# EAGLE board main (EAGLE 9.0.0)
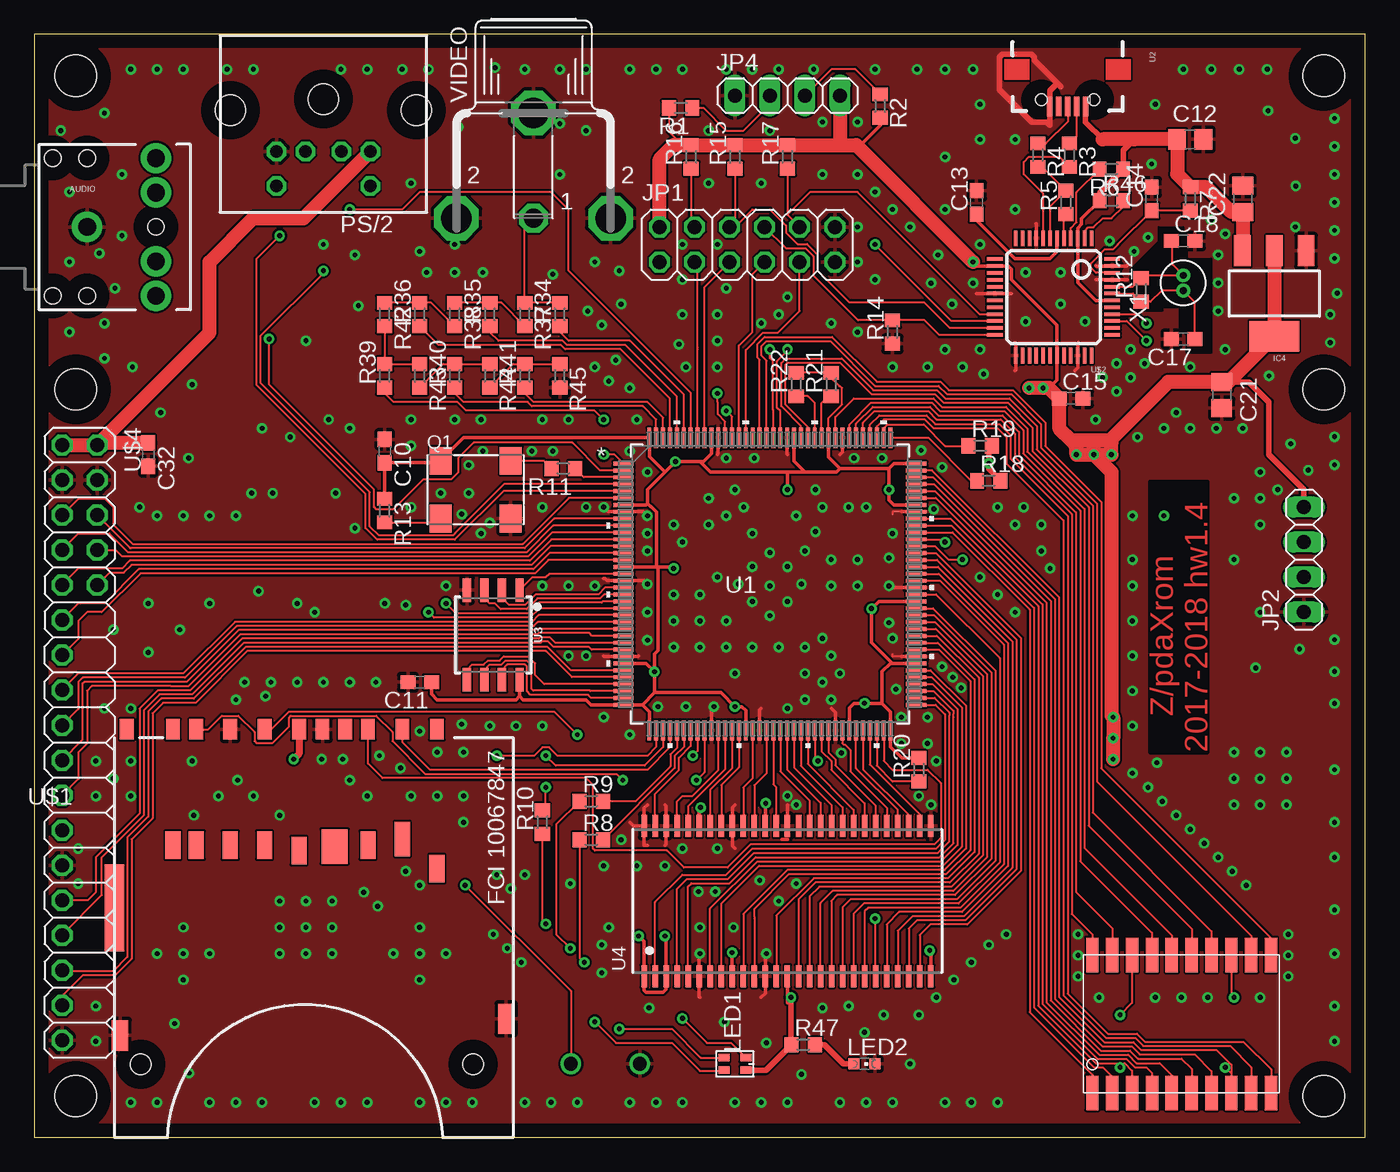
[diagram p3: board, top side]
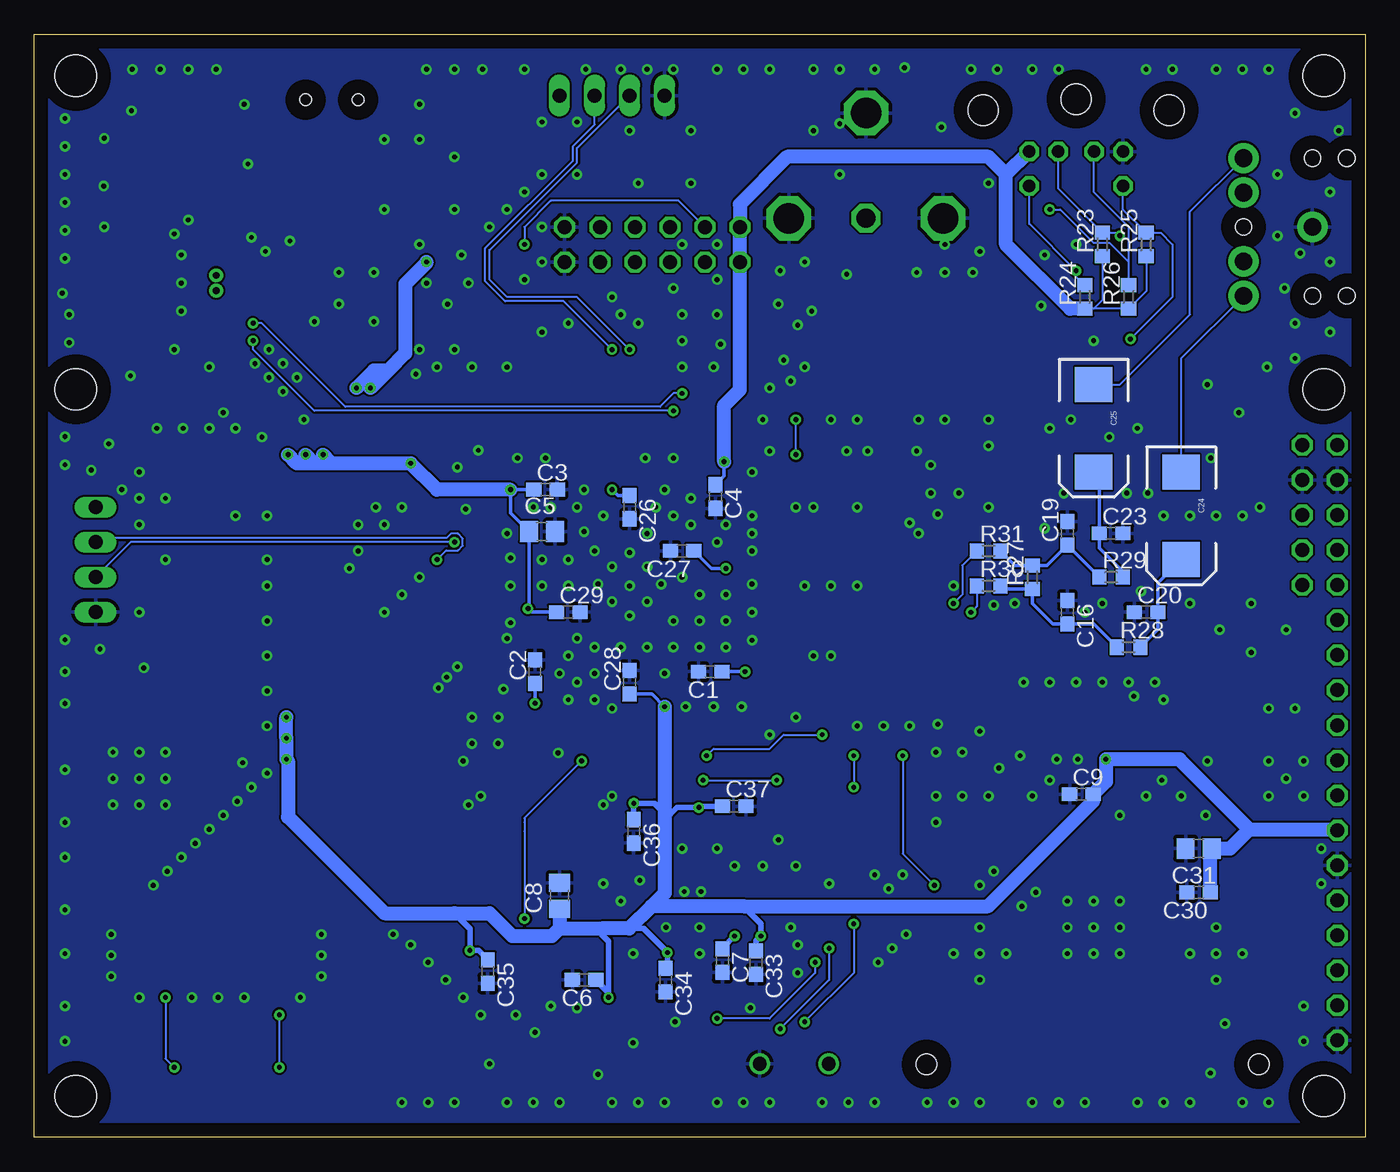
[diagram p4: board, bottom side, seen from below]

Size 96.5 x 80 mm. Coordinates in mm from the lower left corner, seen from the top.
Outline: 0,0 96.5,0 96.5,80 0,80 0,0
Copper layers (1*16): Top 0.035mm / dielectric 1.5mm / Bottom 0.035mm
Design rules "default *": minimum track width 6mil, minimum drill 0.35mm, track to track 6mil, track to pad 6mil, pad to pad 6mil, via to via 6mil, smd to smd 6mil, copper to edge 40mil, drill to drill 6mil, minimum pad ring 10mil, minimum via ring 8mil, stop-mask expansion 4mil, vias tented up to drill 0.4mm, thermal gap 10mil
Holes 3 mm at 3,3 93.5,77 93.5,3 3,77 3,54.26 93.5,54.26
tRestrict: area 79,56.9 to 85.3,66; area 57.8,51.4 to 59.1,52.1; area 54,51.4 to 55.2,52.1; area 76.7,2 to 89.4,2.5; area 76.7,13.7 to 89.4,14.2

## Footprints (pad centres in the part's own frame; a part is rotated, then mirrored left to right if it is on the bottom)
AUDIO-JACK = drill 1.3 pad 2.184: RING 5,5; RSH 5,2.5; SLEEVE 0,0; TIP 5,-5; TSH 5,-2.5 | hole 1.2: 0,5; -2.5,5; -2.5,-5; 0,-5; 5,0
C0603 = smd 1.1 x 1: 1 -0.85,0; 2 0.85,0
C0805 = smd 1.3 x 1.5: 1 -0.95,0; 2 0.95,0
EIA7343 = smd 2.55 x 2.7: A 3.17,0; C -3.17,0
SOT223 = smd 1.219 x 2.235: 1 -2.311,-3.099; 2 0,-3.099; 3 2.311,-3.099 | smd 3.6 x 2.2: 4 0,3.099
2X06 = drill 1.016 octagon: 1 -6.35,-1.27; 2 -6.35,1.27; 3 -3.81,-1.27; 4 -3.81,1.27; 5 -1.27,-1.27; 6 -1.27,1.27; 7 1.27,-1.27; 8 1.27,1.27; 9 3.81,-1.27; 10 3.81,1.27; 11 6.35,-1.27; 12 6.35,1.27
1X04 = drill 1.016 long: 1 -3.81,0; 2 -1.27,0; 3 1.27,0; 4 3.81,0
19-237/R6GHBHC-A04/2T = smd 0.55 x 0.8: P$1 0.45,-0.8; P$2 0.45,0.8; P$3 -0.45,-0.8; P$4 -0.45,0.8
CHIPLED_0603 = smd 0.8 x 0.8: A 0,-0.75; C 0,0.75
MDIN06SS = drill 0.9 octagon: 1 1.3,8.5; 2 -1.3,8.5; 3 3.4,8.5; 4 -3.4,8.5; 5 3.4,11; 6 -3.4,11 | hole 2.2: -6.75,5.5; 0,4.7; 6.75,5.5
7.0X5.0_KXO-82-TCXO = smd 1.6 x 2: 1 -2.54,-2.1; 2 2.54,-2.1; 3 2.54,2.1; 4 -2.54,2.1
R0603 = smd 1 x 1.1: 1 -0.85,0; 2 0.85,0
TQFP144 = smd 1.473 x 0.279: 1 -10.617,8.75; 2 -10.617,8.25; 3 -10.617,7.75; 4 -10.617,7.25; 5 -10.617,6.75; 6 -10.617,6.25; 7 -10.617,5.75; 8 -10.617,5.25; 9 -10.617,4.75; 10 -10.617,4.25; 11 -10.617,3.75; 12 -10.617,3.25; 13 -10.617,2.75; 14 -10.617,2.25; 15 -10.617,1.75; 16 -10.617,1.25; 17 -10.617,0.75; 18 -10.617,0.25; 19 -10.617,-0.25; 20 -10.617,-0.75; 21 -10.617,-1.25; 22 -10.617,-1.75; 23 -10.617,-2.25; 24 -10.617,-2.75; 25 -10.617,-3.25; 26 -10.617,-3.75; 27 -10.617,-4.25; 28 -10.617,-4.75; 29 -10.617,-5.25; 30 -10.617,-5.75; 31 -10.617,-6.25; 32 -10.617,-6.75; 33 -10.617,-7.25; 34 -10.617,-7.75; 35 -10.617,-8.25; 36 -10.617,-8.75; 73 10.617,-8.75; 74 10.617,-8.25; 75 10.617,-7.75; 76 10.617,-7.25; 77 10.617,-6.75; 78 10.617,-6.25; 79 10.617,-5.75; 80 10.617,-5.25; 81 10.617,-4.75; 82 10.617,-4.25; 83 10.617,-3.75; 84 10.617,-3.25; 85 10.617,-2.75; 86 10.617,-2.25; 87 10.617,-1.75; 88 10.617,-1.25; 89 10.617,-0.75; 90 10.617,-0.25; 91 10.617,0.25; 92 10.617,0.75; 93 10.617,1.25; 94 10.617,1.75; 95 10.617,2.25; 96 10.617,2.75; 97 10.617,3.25; 98 10.617,3.75; 99 10.617,4.25; 100 10.617,4.75; 101 10.617,5.25; 102 10.617,5.75; 103 10.617,6.25; 104 10.617,6.75; 105 10.617,7.25; 106 10.617,7.75; 107 10.617,8.25; 108 10.617,8.75 | smd 0.279 x 1.473: 37 -8.75,-10.617; 38 -8.25,-10.617; 39 -7.75,-10.617; 40 -7.25,-10.617; 41 -6.75,-10.617; 42 -6.25,-10.617; 43 -5.75,-10.617; 44 -5.25,-10.617; 45 -4.75,-10.617; 46 -4.25,-10.617; 47 -3.75,-10.617; 48 -3.25,-10.617; 49 -2.75,-10.617; 50 -2.25,-10.617; 51 -1.75,-10.617; 52 -1.25,-10.617; 53 -0.75,-10.617; 54 -0.25,-10.617; 55 0.25,-10.617; 56 0.75,-10.617; 57 1.25,-10.617; 58 1.75,-10.617; 59 2.25,-10.617; 60 2.75,-10.617; 61 3.25,-10.617; 62 3.75,-10.617; 63 4.25,-10.617; 64 4.75,-10.617; 65 5.25,-10.617; 66 5.75,-10.617; 67 6.25,-10.617; 68 6.75,-10.617; 69 7.25,-10.617; 70 7.75,-10.617; 71 8.25,-10.617; 72 8.75,-10.617; 109 8.75,10.617; 110 8.25,10.617; 111 7.75,10.617; 112 7.25,10.617; 113 6.75,10.617; 114 6.25,10.617; 115 5.75,10.617; 116 5.25,10.617; 117 4.75,10.617; 118 4.25,10.617; 119 3.75,10.617; 120 3.25,10.617; 121 2.75,10.617; 122 2.25,10.617; 123 1.75,10.617; 124 1.25,10.617; 125 0.75,10.617; 126 0.25,10.617; 127 -0.25,10.617; 128 -0.75,10.617; 129 -1.25,10.617; 130 -1.75,10.617; 131 -2.25,10.617; 132 -2.75,10.617; 133 -3.25,10.617; 134 -3.75,10.617; 135 -4.25,10.617; 136 -4.75,10.617; 137 -5.25,10.617; 138 -5.75,10.617; 139 -6.25,10.617; 140 -6.75,10.617; 141 -7.25,10.617; 142 -7.75,10.617; 143 -8.25,10.617; 144 -8.75,10.617
USB-MICRO-SMD = smd 1.4 x 0.4: D+1 2.7,0; D-1 2.7,0.65; GND1 2.7,-1.3; ID1 2.7,-0.65; VBUS1 2.7,1.3 | hole 0.85: 2.2,1.9; 2.2,-1.9
SOIC-8 = smd 0.61 x 1.702: 1 -1.905,-3.251; 2 -0.635,-3.251; 3 0.635,-3.251; 4 1.905,-3.251; 5 1.905,3.251; 6 0.635,3.251; 7 -0.635,3.251; 8 -1.905,3.251
TSOP54 = smd 0.4 x 1.6: 1 -10.4,-5.45; 2 -9.6,-5.45; 3 -8.8,-5.45; 4 -8,-5.45; 5 -7.2,-5.45; 6 -6.4,-5.45; 7 -5.6,-5.45; 8 -4.8,-5.45; 9 -4,-5.45; 10 -3.2,-5.45; 11 -2.4,-5.45; 12 -1.6,-5.45; 13 -0.8,-5.45; 14 0,-5.45; 15 0.8,-5.45; 16 1.6,-5.45; 17 2.4,-5.45; 18 3.2,-5.45; 19 4,-5.45; 20 4.8,-5.45; 21 5.6,-5.45; 22 6.4,-5.45; 23 7.2,-5.45; 24 8,-5.45; 25 8.8,-5.45; 26 9.6,-5.45; 27 10.4,-5.45; 28 10.4,5.45; 29 9.6,5.45; 30 8.8,5.45; 31 8,5.45; 32 7.2,5.45; 33 6.4,5.45; 34 5.6,5.45; 35 4.8,5.45; 36 4,5.45; 37 3.2,5.45; 38 2.4,5.45; 39 1.6,5.45; 40 0.8,5.45; 41 0,5.45; 42 -0.8,5.45; 43 -1.6,5.45; 44 -2.4,5.45; 45 -3.2,5.45; 46 -4,5.45; 47 -4.8,5.45; 48 -5.6,5.45; 49 -6.4,5.45; 50 -7.2,5.45; 51 -8,5.45; 52 -8.8,5.45; 53 -9.6,5.45; 54 -10.4,5.45
SD-MMC_SOCKET-PP = smd 1 x 1.5: 1 6.875,29.6; 2 4.375,29.6; 3 1.075,29.6; 4 -0.625,29.6; 5 -3.125,29.6; 6 -5.625,29.6; 7 -8.075,29.6; 8 -9.775,29.6; 9 9.375,29.6; CD 2.725,29.6; WP -13.125,29.6 | smd 1.4 x 6.3: 14 -14,16.65 | smd 1.2 x 2.2: SHLD1 -13.6,7.4; SHLD2 14.4,8.6 | smd 1.1 x 2: SW -9.775,21.2; SW1 -8.075,21.2; SW2 -5.625,21.2; SW3 -3.125,21.2; SW4 -0.625,20.8; SW6 4.375,21.2; SW8 9.375,19.5 | smd 1.9 x 2.5: SW5 1.95,21.1 | smd 1.1 x 2.5: SW7 6.875,21.65 | hole 1.5: -12.1,5.3; 12,5.3
LQFP-48 = smd 0.254 x 1.143: 1 -2.75,-4.25; 2 -2.25,-4.25; 3 -1.75,-4.25; 4 -1.25,-4.25; 5 -0.75,-4.25; 6 -0.25,-4.25; 7 0.25,-4.25; 8 0.75,-4.25; 9 1.25,-4.25; 10 1.75,-4.25; 11 2.25,-4.25; 12 2.75,-4.25; 25 2.75,4.25; 26 2.25,4.25; 27 1.75,4.25; 28 1.25,4.25; 29 0.75,4.25; 30 0.25,4.25; 31 -0.25,4.25; 32 -0.75,4.25; 33 -1.25,4.25; 34 -1.75,4.25; 35 -2.25,4.25; 36 -2.75,4.25 | smd 1.143 x 0.254: 13 4.25,-2.75; 14 4.25,-2.25; 15 4.25,-1.75; 16 4.25,-1.25; 17 4.25,-0.75; 18 4.25,-0.25; 19 4.25,0.25; 20 4.25,0.75; 21 4.25,1.25; 22 4.25,1.75; 23 4.25,2.25; 24 4.25,2.75; 37 -4.25,2.75; 38 -4.25,2.25; 39 -4.25,1.75; 40 -4.25,1.25; 41 -4.25,0.75; 42 -4.25,0.25; 43 -4.25,-0.25; 44 -4.25,-0.75; 45 -4.25,-1.25; 46 -4.25,-1.75; 47 -4.25,-2.25; 48 -4.25,-2.75
GS2020CR = smd 0.9 x 2.5: 1 -6.46,-5.02; 2 -5.02,-5.02; 3 -3.58,-5.02; 4 -2.14,-5.02; 5 -0.7,-5.02; 6 0.74,-5.02; 7 2.18,-5.02; 8 3.62,-5.02; 9 5.06,-5.02; 10 6.5,-5.02; 11 6.5,4.98; 12 5.06,4.98; 13 3.62,4.98; 14 2.18,4.98; 15 0.74,4.98; 16 -0.7,4.98; 17 -2.14,4.98; 18 -3.58,4.98; 19 -5.02,4.98; 20 -6.46,4.98
2X18_ZPDAXROM_IO = drill 1.016 octagon: 1 -21.59,-1.27; 2 -21.59,1.27; 3 -19.05,-1.27; 4 -19.05,1.27; 5 -16.51,-1.27; 6 -16.51,1.27; 7 -13.97,-1.27; 8 -13.97,1.27; 9 -11.43,-1.27; 10 -11.43,1.27; 11 -8.89,-1.27; 13 -6.35,-1.27; 15 -3.81,-1.27; 17 -1.27,-1.27; 19 1.27,-1.27; 21 3.81,-1.27; 23 6.35,-1.27; 25 8.89,-1.27; 27 11.43,-1.27; 29 13.97,-1.27; 31 16.51,-1.27; 33 19.05,-1.27; 35 21.59,-1.27
SWITCH_6X6 = drill 1: P$1 -2.5,0; P$2 2.5,0
TOBU3 = drill 1.397 octagon: 1 0,-2.54 | drill 2.21 octagon: 2 5.588,-2.54; 2@1 -5.588,-2.54; 2@2 0,5.08
WATCH-3X8 = drill 0.5 pad 0.9: 1 -0.55,0; 2 0.55,0

## Placement (x,y rotation side)
AUDIO  AUDIO-JACK2PTH  [AUDIO-JACK]  3.81,66.04 0 top
C1  100nF  [C0603]  47.5,33.78 180 bottom
C2  100nF  [C0603]  60.2,33.78 90 bottom
C3  100nF  [C0603]  59.44,46.99 0 bottom
C4  100nF  [C0603]  47.12,46.48 270 bottom
C5  10uF  [C0805]  59.69,43.94 0 bottom
C6  100nF  [C0603]  56.64,11.43 180 bottom
C7  100nF  [C0603]  46.61,12.83 270 bottom
C8  10uF  [C0805]  58.42,17.53 90 bottom
C9  100nF  [C0603]  20.57,24.89 0 bottom
C10  100nF  [C0603]  25.4,49.78 270 top
C11  100nF  [C0603]  27.94,33.02 180 top
C12  10uF  [C0805]  83.82,72.39 0 top
C13  100nF  [C0603]  68.33,67.82 90 top
C14  100nF  [C0603]  81.03,68.07 90 top
C15  100nF  [C0603]  75.18,53.59 0 top
C16  10nF  [C0603]  21.59,38.1 270 bottom
C17  27pF  [C0603]  83.31,57.91 180 top
C18  27pF  [C0603]  83.31,65.02 0 top
C19  10nF  [C0603]  21.59,43.81 90 bottom
C20  10nF  [C0603]  15.88,38.1 0 bottom
C21  10uF  [C0805]  86.11,53.85 270 top
C22  10uF  [C0805]  87.63,68.07 90 top
C23  10nF  [C0603]  18.41,43.81 0 bottom
C24  100uF  [EIA7343]  13.34,45.09 270 bottom
C25  100uF  [EIA7343]  19.68,51.44 270 bottom
C26  100nF  [C0603]  53.34,45.72 270 bottom
C27  100nF  [C0603]  49.53,42.55 180 bottom
C28  100nF  [C0603]  53.34,33.02 90 bottom
C29  100nF  [C0603]  57.78,38.1 0 bottom
C30  100nF  [C0603]  12.06,17.78 180 bottom
C31  10uF  [C0805]  12.06,20.95 180 bottom
C32  100nF  [C0603]  8.26,49.53 270 top
C33  100nF  [C0603]  44.17,12.67 270 bottom
C34  100nF  [C0603]  50.72,11.4 270 bottom
C35  100nF  [C0603]  63.63,12.04 270 bottom
C36  100nF  [C0603]  53.04,22.2 270 bottom
C37  100nF  [C0603]  45.75,24.03 0 bottom
IC4  [SOT223]  89.92,61.21 180 top
JP1  [2X06]  51.69,64.77 0 top
JP2  [1X04]  92.08,41.91 90 top
JP4  [1X04]  54.61,75.56 0 top
LED1  19-237/R6GHBHC-A04/2T  [19-237/R6GHBHC-A04/2T]  50.8,5.33 90 top
LED2  [CHIPLED_0603]  60.2,5.33 270 top
PS/2  [MDIN06SS]  20.95,80.01 180 top
Q1  [7.0X5.0_KXO-82-TCXO]  32,46.99 0 top
R1  4.7K  [R0603]  46.86,74.68 180 top
R2  4.7K  [R0603]  61.34,74.8 270 top
R3  27  [R0603]  75.06,71.25 270 top
R4  27  [R0603]  72.77,71.25 270 top
R5  1k5  [R0603]  74.8,67.82 90 top
R6  1K  [R0603]  78.11,70.23 180 top
R7  470  [R0603]  83.82,68.07 270 top
R8  1K  [R0603]  40.39,21.59 0 top
R9  1K  [R0603]  40.39,24.38 0 top
R10  1K  [R0603]  36.83,22.86 90 top
R11  10  [R0603]  38.35,48.51 180 top
R12  DNP  [R0603]  80.26,61.47 90 top
R13  DNP  [R0603]  25.4,45.47 270 top
R14  4.7K  [R0603]  62.23,58.42 90 top
R15  DNP  [R0603]  50.8,71.12 90 top
R16  DNP  [R0603]  47.62,71.12 90 top
R17  DNP  [R0603]  54.61,71.12 90 top
R18  10K  [R0603]  69.22,47.62 0 top
R19  10K  [R0603]  68.58,50.16 0 top
R20  10K  [R0603]  64.14,26.67 90 top
R21  10K  [R0603]  57.78,54.61 90 top
R22  10K  [R0603]  55.24,54.61 90 top
R23  10K  [R0603]  19.05,64.77 90 bottom
R24  10K  [R0603]  20.32,60.96 90 bottom
R25  10K  [R0603]  15.88,64.77 90 bottom
R26  10K  [R0603]  17.14,60.96 90 bottom
R27  1K  [R0603]  24.13,40.64 90 bottom
R28  560  [R0603]  17.14,35.56 0 bottom
R29  560  [R0603]  18.41,40.64 0 bottom
R30  560  [R0603]  27.3,40.01 0 bottom
R31  560  [R0603]  27.3,42.55 0 bottom
R34  230  [R0603]  38.1,59.69 90 top
R35  230  [R0603]  33.02,59.69 90 top
R36  230  [R0603]  27.94,59.69 90 top
R37  115  [R0603]  35.56,59.69 270 top
R38  115  [R0603]  30.48,59.69 270 top
R39  230  [R0603]  25.4,55.24 90 top
R40  230  [R0603]  30.48,55.24 90 top
R41  230  [R0603]  35.56,55.24 90 top
R42  115  [R0603]  25.4,59.69 270 top
R43  115  [R0603]  27.94,55.24 270 top
R44  115  [R0603]  33.02,55.24 270 top
R45  230  [R0603]  38.1,55.24 270 top
R46  10K  [R0603]  78.11,67.94 0 top
R47  1K  [R0603]  55.75,6.73 0 top
U1  LCMXO2-7000HC-4TG144I  [TQFP144]  53.34,40.13 0 top
U2  [USB-MICRO-SMD]  74.93,77.47 270 top
U3  W25Q32FV  [SOIC-8]  33.27,36.45 180 top
U4  K4S561632E-TC  [TSOP54]  54.61,17.14 0 top
U$1  [SD-MMC_SOCKET-PP]  19.81,0 0 top
U$2  FT2232D  [LQFP-48]  73.91,60.96 180 top
U$3  GS2020CR-G  [GS2020CR]  83.19,8.26 0 top
U$4  ZPDAXROM_IO  [2X18_ZPDAXROM_IO]  3.27,28.63 270 top
U$12  SWITCH_6X6  [SWITCH_6X6]  41.4,5.33 0 top
VIDEO  TOBU3  [TOBU3]  36.2,69.22 0 top
X1  CRYSTALS-NOGND-WATCH-3X8  [WATCH-3X8]  83.31,61.98 90 top

## Tracks (layer width: path | path; a pad name or v marks a point on that pad's centre or on a via)
+3V3  (via drill 0.35)
  Top 0.152: U1.118 57.59,52.19 58.56,53.16 58.56,54.35 58.43,54.49 58.37,54.49 57.59,55.27 R21.2 R22.2 | R1.2 46.01,72.95 46.99,71.97
  Top 0.254: R13.1 C10.2 29.31,48.93 Q1.4 31.12,50.75 U1.144 44.59,49.39 45.72,48.26 | U1.7 44.36,45.88 44.45,45.97 | 44.45,45.97 44.45,46.99 45.72,48.26 | 45.72,48.26 v46.48,49.02 48.26,49.02 | U1.135 49.09,49.6 48.51,49.02 48.26,49.02 | U1.108 62.34,48.88 61.98,48.51 | 61.98,48.51 v61.98,46.99 61.98,46.23 62.32,45.88 U1.102 | U1.118 57.59,49.34 58.42,48.51 | 58.42,48.51 61.98,48.51 | 61.47,31.5 62.09,30.87 U1.72 62.09,28.33 62.9,27.52 R20.2 | 61.47,31.5 v60.2,31.5 59.44,31.5 59.09,31.15 U1.66 | 62.06,34.38 62.15,34.46 60.71,35.9 v60.71,38.35 61.23,38.88 U1.88 | 62.06,34.38 61.47,33.78 61.47,31.5 | U1.30 44.36,34.38 v44.96,33.78 | 44.08,31.38 U1.36 40.37,31.38 40.01,31.75 35.43,31.75 35.18,32 | 44.08,31.38 44.96,32.26 | 44.96,32.26 v44.96,33.78 | U1.51 51.59,30.96 51.31,31.24 v50.8,31.24 49.78,32.26 44.96,32.26 | U1.37 44.59,30.87 44.08,31.38 | v44.96,33.78 44.96,35.05 45.21,35.31 45.21,41.26 45.11,41.36 | 48.26,49.02 49.02,48.26 54.61,48.26 | 58.42,48.51 58.17,48.26 55.88,48.26 | 54.61,48.26 55.88,48.26 | U1.123 55.09,49.05 55.88,48.26 | U3.8 35.18,32 | 35.18,32 34.92,31.75 29.21,31.75 28.79,32.17 C11.1 | U1.16 45.09,41.38 | 45.09,41.38 46.25,41.38 v46.35,41.27 | 45.11,41.36 45.09,41.38 | 44.45,45.97 44.68,45.74 44.72,45.74 45.11,45.36 45.11,41.36 | 54.61,48.26 v54.61,46.99 | R2.2 61.34,73.41 59.91,71.97 59.6,71.97 | v68.07,63.5 68.36,63.21 U$2.14 70.65,63.21 70.87,62.99 70.87,62.23 74.17,58.93 U$2.31 74.16,54.95 73.57,54.36 | U1.79 62.06,34.38 | U4.14 54.61,9.78 v54.86,10.16 | v43.81,14.61 44.21,14.21 U4.1 44.21,10.65 44.35,10.52 45.57,10.52 45.81,10.76 U4.3 45.81,14.52 v45.72,14.61 | U4.49 48.21,23.83 v48.31,23.93
  Top 0.254: U4.43 53.01,24.21 v53.03,24.23 | U4.9 50.6,11.71 v50.6,13.41 | U4.27 65.01,13.48 v64.92,13.56
  Top 0.406: R19.2 69.22,49.95 v69.22,48.9 69.22,48.48 R18.2 | v54.86,10.16 54.86,6.77 R47.1 53.06,4.88 LED1.P$3 | JP2.4 92.08,46.99 89.53,49.53 89.53,53.34 88.08,54.8 86.6,54.8
  Top 0.508: U$1.4 19.19,27.82 v18.8,27.43
  Top 1.016: 77.98,50.55 76.71,50.55 | 76.71,50.55 75.18,50.55 | 58.42,71.97 R17.2 R15.2 R16.2 46.99,71.97 46.35,71.97 45.34,70.95 JP1.2 | 58.42,71.97 59.6,71.97 v68.07,63.5 | 75.18,50.55 75.56,50.16 v75.56,49.53 v76.83,49.53 | v76.83,49.53 76.83,50.42 76.71,50.55 | 77.98,50.55 78.11,50.42 v78.11,49.53 v76.83,49.53 | v78.23,27.43 v78.23,28.96 v78.23,30.48 78.11,30.61 78.11,48.26 v76.83,49.53 | 75.18,50.55 74.33,51.4 C15.1 73.57,54.36 v73.15,54.36 v72.14,54.36 | JP4.4 58.42,71.97 | 77.98,50.55 82.23,54.8 C21.1 86.6,54.8 IC4.4 IC4.2 | U$4.2 12.7,58.38 12.7,63.5 15.88,66.67 19.52,66.67 PS/2.4 | U$4.1 U$4.2 | C32.1 4.7,50.38 U$4.2
  Bottom 0.152: R25.1 15.88,61.38 R26.1 19.68,60.11 | 19.68,60.11 R24.1 | R23.1 19.05,60.74 19.68,60.11
  Bottom 0.254: C3.1 v61.98,46.99 61.98,45.28 C5.1 60.64,38.42 v60.71,38.35 60.45,38.1 C29.1 | C2.1 v60.2,31.5 | C1.1 v44.96,33.78 | C27.1 47.41,41.27 v46.35,41.27 | C4.1 46.48,47.97 v46.48,49.02 | C26.1 54.19,46.57 v54.61,46.99 | C28.1 51.73,32.17 v50.8,31.24
  Bottom 0.406: 55.37,15.15 55.37,14.73 54.86,14.22 v54.86,10.16 | 53.36,15.15 52.34,15.15 v50.6,13.41 50.6,12.38 C34.1 | 45.09,16.76 43.81,15.49 v43.81,14.61 44.17,14.25 C33.1 | C37.1 48.21,24.03 v48.31,23.93 49.89,23.93 50.8,23.01 | C36.1 v53.03,24.23 51.54,24.23 50.8,23.5 | C35.1 64.3,13.56 v64.92,13.56 64.92,15.14 66.04,16.26 | 54.86,10.35 v54.86,10.16 | C7.1 46.61,13.72 v45.72,14.61 | C6.1 54.86,10.5 v54.86,10.16
  Bottom 1.016: 51.75,16.76 45.09,16.76 27.34,16.76 19.72,24.38 C9.2 18.8,25.82 v18.8,27.43 13.46,27.43 8.38,22.35 | v50.8,31.24 50.8,23.5 50.8,23.01 50.8,17.71 51.75,16.76 | v61.98,46.99 67.31,46.99 v69.22,48.9 74.93,48.9 | 74.93,48.9 v75.56,49.53 | v46.48,49.02 46.48,53.09 45.34,54.23 JP1.1 JP1.2 45.34,67.69 41.91,71.12 27.3,71.12 26.04,69.85 | v78.23,30.48 v78.23,28.96 v78.23,27.43 78.11,27.3 78.11,23.24 71.12,16.26 66.04,16.26 63.5,16.26 61.85,14.61 58.97,14.61 58.42,15.15 | 70.87,55.63 69.62,56.87 69.62,61.9 68.07,63.45 v68.07,63.5 | 70.87,55.63 v72.14,54.36 | 74.93,48.9 76.2,48.9 | 76.2,48.9 v76.83,49.53 | 76.2,48.9 77.47,48.9 v78.11,49.53 | 70.87,55.63 71.88,55.63 v73.15,54.36 | R24.1 21.38,60.11 26.04,64.77 26.04,69.85 | U$4.23 2.07,22.35 8.38,22.35 | 26.04,69.85 24.38,71.51 PS/2.4 | 8.38,22.35 9.78,20.95 C31.1 11.21,20.86 C30.1 | 51.75,16.76 53.36,15.15 55.37,15.15 58.42,15.15 | C8.1 58.42,15.15
+5V
  Top 0.254: U$2.42 76.97,60.71 | 76.97,60.71 76.96,60.71 | 76.97,60.71 75.66,62.01 U$2.3 75.66,65.95 75.94,66.23 75.94,66.63 R46.1
  Top 0.406: 76.23,74.14 U2.VBUS1 76.23,73.63 77.47,72.39 | 82.62,72.14 C12.1 | R46.1 77.25,68.53 R6.1 78.95,71.59 79.76,72.39
  Top 1.016: 77.47,72.39 79.76,72.39 C12.1 82.87,69.87 R7.1 85,68.92 86.8,67.12 C22.1 87.63,64.34 IC4.3
AUDIO_L  (via drill 0.35)
  Top 0.152: U1.22 36.63,38.38 35.96,37.71 28.97,37.71 v28.57,38.1
  Bottom 0.152: R30.1 28.16,38.52 v28.57,38.1
AUDIO_R  (via drill 0.35)
  Top 0.152: U1.21 41.24,38.88 41.14,38.79 36.61,38.79 35.83,38.01 31.75,38.01 31.58,38.01 30.57,38.01 v29.84,38.73
  Bottom 0.152: R31.1 29.21,41.49 29.21,39.37 v29.84,38.73
BTN_RES  (via drill 0.35)
  Top 0.152: U1.38 45.09,28.33 44.45,27.69 37.94,27.69 37.34,28.29 36.83,28.29 36.23,27.69 v33.53,27.69 | v31.24,18.29 38.9,10.63 U$12.P$1
  Bottom 0.152: v33.53,27.69 33.53,20.57 v31.24,18.29
DONE
  Top 0.152: U1.109 64.82,50.75 67.94,47.62 R18.1
DRAM_A0
  Top 0.152: U1.92 65.59,40.88 70.61,35.86 70.61,19.7 67.27,16.36 62.71,16.36 61.81,15.46 U4.23
DRAM_A1
  Top 0.152: U1.93 65.53,41.38 70.92,35.99 70.92,19.57 67.4,16.05 63.68,16.05 62.61,14.98 U4.24
DRAM_A2
  Top 0.152: U1.94 65.46,41.88 71.22,36.12 71.22,19.44 67.53,15.75 64.01,15.75 63.41,15.15 U4.25
DRAM_A3
  Top 0.152: U1.95 65.39,42.38 71.53,36.24 71.53,19.32 67.65,15.44 64.97,15.44 64.21,14.68 U4.26
DRAM_A4
  Top 0.152: U1.69 60.59,27.04 64.21,23.42 U4.29
DRAM_A5
  Top 0.152: U4.30 63.41,23.38 60.09,26.7 U1.68
DRAM_A6
  Top 0.152: U4.31 62.61,23.75 59.59,26.77 U1.67
DRAM_A7
  Top 0.152: U4.32 61.81,23.91 59.17,26.56 59.17,28.1 58.77,28.5 58.68,28.5 58.59,28.58 U1.65
DRAM_A8
  Top 0.152: U4.33 61.01,22.86 61.01,23.45 61.01,24.08 58.09,27 58.09,27.43 57.59,27.93 U1.63
DRAM_A9
  Top 0.152: U1.62 57.09,28 57.78,27.3 57.78,26.67 60.21,24.25 60.21,23.81 60.21,23.5 U4.34
DRAM_A10  (via drill 0.35)
  Top 0.152: U4.22 61.01,15.82 v60.96,15.88 | U1.61 56.59,27.54 v56.82,27.3
  Bottom 0.152: v60.96,15.88 60.96,22.23 60.96,22.86 60.96,23.16 v56.82,27.3
DRAM_A11
  Top 0.152: U1.60 56.09,27.09 59.41,23.77 U4.35
DRAM_A12
  Top 0.152: U1.59 55.59,26.96 58.61,23.94 U4.36
DRAM_BA0
  Top 0.152: U1.89 65.39,39.38 70,34.77 70,19.95 67.02,16.97 60.15,16.97 59.41,16.23 U4.20
DRAM_BA1
  Top 0.152: U1.91 65.66,40.38 70.31,35.74 70.31,19.82 67.15,16.66 60.48,16.66 60.21,16.39 U4.21
DRAM_CAS
  Top 0.152: U1.85 65.31,37.38 69.09,33.6 69.09,20.33 66.64,17.88 57.89,17.88 57.01,17 U4.17
DRAM_CKE
  Top 0.152: U1.58 55.09,26.82 57.81,24.11 U4.37
DRAM_CLK
  Top 0.152: U1.57 54.59,26.69 57.01,24.27 U4.38
DRAM_CS
  Top 0.152: U1.87 65.17,38.38 69.7,33.85 69.7,20.07 66.89,17.27 59.18,17.27 58.61,16.7 U4.19
DRAM_DQ0
  Top 0.152: U4.2 45.01,17.07 46.99,19.05 50.16,19.05 52.07,20.95 65.41,20.95 66.04,21.59 66.04,30.68 65.34,31.38 U1.73
DRAM_DQ1
  Top 0.152: U4.4 46.61,18.04 47.32,18.75 50.29,18.75 52.18,20.64 65.52,20.64 66.34,21.46 66.34,30.48 66.34,30.61 66.34,30.81 65.27,31.88 U1.74
DRAM_DQ2
  Top 0.152: U4.5 47.41,18.2 47.65,18.44 50.42,18.44 52.3,20.32 65.63,20.32 66.65,21.34 66.65,30.48 66.65,30.73 66.65,30.94 65.2,32.38 U1.75
DRAM_DQ3
  Top 0.152: U1.76 65.14,32.88 66.95,31.06 66.95,21.21 65.76,20.02 52.42,20.02 49.01,16.6 U4.7
DRAM_DQ4
  Top 0.152: U1.77 65.07,33.38 67.26,31.19 67.26,21.09 65.89,19.71 52.55,19.71 49.81,16.97 U4.8
DRAM_DQ5
  Top 0.152: U1.78 65,33.88 67.56,31.32 67.56,20.96 66.01,19.41 54.61,19.41 51.41,16.21 U4.10
DRAM_DQ6
  Top 0.152: U1.81 65.58,35.38 67.87,33.1 67.87,20.83 66.14,19.1 54.74,19.1 52.21,16.57 52.21,16.02 52.21,15.88 U4.11
DRAM_DQ7
  Top 0.152: U1.82 65.51,35.88 68.17,33.22 68.17,20.71 66.26,18.8 56.52,18.8 53.81,16.09 U4.13
DRAM_DQ8
  Top 0.152: U4.42 53.81,25.4 53.59,25.62 U1.55
DRAM_DQ9
  Top 0.152: U1.54 53.09,26.42 52.21,25.54 U4.44
DRAM_DQ10
  Top 0.152: U1.52 52.09,26.05 51.41,25.38 U4.45
DRAM_DQ11
  Top 0.152: U1.50 51.09,26.84 49.81,25.56 U4.47
DRAM_DQ12
  Top 0.152: U1.49 50.59,26.77 49.01,25.19 U4.48
DRAM_DQ13
  Top 0.152: U1.48 50.09,26.7 47.41,24.02 U4.50
DRAM_DQ14
  Top 0.152: U1.47 49.59,26.63 47.72,24.77 46.99,24.77 46.61,24.39 U4.51
DRAM_DQ15
  Top 0.152: U1.43 47.59,28.38 46.74,27.53 46.74,27.3 46.74,26.66 45.01,24.93 U4.53
DRAM_DQM
  Top 0.152: U1.56 54.09,26.55 56.21,24.43 U4.39
DRAM_LDQM
  Top 0.152: U1.83 65.44,36.38 68.48,33.35 68.48,20.58 66.39,18.49 56.64,18.49 55.41,17.26 U4.15
DRAM_RAS
  Top 0.152: U1.86 65.24,37.88 69.39,33.73 69.39,20.2 66.77,17.58 58.22,17.58 57.78,17.14 57.78,11.72 U4.18
DRAM_WE
  Top 0.152: U1.84 65.38,36.88 68.78,33.48 68.78,20.45 66.52,18.19 56.92,18.19 56.21,17.48 U4.16
FLASH_CS
  Top 0.152: U1.17 37.34,40.88 37.08,40.61 36.09,40.61 U3.1
FLASH_HOLD
  Top 0.152: U1.35 40.38,31.88 40.15,32.11 35.99,32.11 35.71,32.38 35.71,34.14 35.57,34.29 34.29,34.29 33.91,33.91 U3.7
FLASH_SCK
  Top 0.152: U3.6 32.64,33.91 33.02,34.29 33.86,34.29 34.16,34.59 35.69,34.59 36.02,34.27 36.02,32.56 36.17,32.41 40.28,32.41 40.31,32.38 U1.34
FLASH_SI
  Top 0.152: U3.5 31.37,33.91 31.75,34.29 32.59,34.29 32.89,34.59 33.73,34.59 34.04,34.9 35.82,34.9 36.32,34.4 36.32,33.53 36.97,32.88 U1.33
FLASH_SO
  Top 0.152: U1.19 41.38,39.88 40.89,39.4 36.36,39.4 35.58,38.62 34.4,38.62 33.91,39.12 U3.2
FLASH_WP
  Top 0.152: U1.20 41.29,39.37 41.02,39.09 36.48,39.09 35.7,38.32 33.81,38.32 33.4,38.73 33.02,38.73 32.64,39.12 U3.3
FPGA_CLOCK
  Top 0.152: U1.3 39.84,47.88 R11.1
GND  (via drill 0.35, 0.35 pad 0.1)
  Top 0.152: 62.87,34.88 62.23,34.88 62.23,35.05 | 62.87,45.38 62.23,45.38 62.23,45.21
  Top 0.254: U$2.9 72.66,66.27 72.64,66.29 | 68.33,61.21 U$2.18 70.86,61.21 70.87,61.21 | 71.12,57.66 71.16,57.61 U$2.25 71.16,55.67 71.12,55.63 | 75.69,57.66 75.66,57.63 U$2.34 75.66,55.85 75.44,55.63 | 79.25,62.23 79.23,62.21 U$2.45 76.98,62.21 76.96,62.23 | 79.25,63.25 79.21,63.21 U$2.47 77,63.21 76.96,63.25 | 43.81,34.92 43.77,34.88 U1.29 41.32,34.88 41.27,34.92 | v44.45,40.13 44.2,40.38 U1.18 41.53,40.38 41.39,40.53 41.27,40.53 | v44.45,45.09 44.15,45.38 U1.8 41.61,45.38 v41.27,45.72 | U1.46 49.09,31.06 v49.28,31.24 | U1.53 52.59,31 52.7,31.11 | U1.64 58.09,30.81 57.78,31.11 | U1.80 62.87,34.88 | U1.90 62.35,39.88 62.23,40.01 | U1.101 62.87,45.38 | U1.116 58.59,49.7 58.42,49.53 | U1.124 54.59,49.55 54.61,49.53 | U1.134 49.59,49.59 49.53,49.53 | U4.41 54.61,24.13 | 50.8,24.13 50.61,23.94 U4.46 50.61,21.14 50.8,20.95 | 45.72,24.13 45.81,24.04 U4.52 45.81,21.26 45.72,21.17 | U4.54 44.21,23.89 44.45,24.13 | U4.54 44.21,21.2 44.24,21.17 44.45,21.17 | U4.54 43.45,22.59 43.18,22.86 | v48.26,13.34 48.21,13.29 U4.6 48.21,10.21 48.26,10.16 | v53.09,13.34 53.01,13.26 U4.12 53.01,10.46 52.7,10.16 | 54.61,21.61 54.23,21.61
  Top 0.406: 73.63,73.44 U2.GND1 73.63,75.92 74.17,76.46 | 73.63,73.44 73.66,73.41 | 73.63,73.44 73.44,73.63 72.35,73.63 69.99,75.98 69.99,78.37 70.2,78.58 72.29,78.58 72.5,78.37 72.5,78.12 74.17,76.46 | 74.17,76.46 74.42,76.2
  other vias: 81.03,70.61 77.98,65.02 79.76,64.26 80.77,65.28 79.5,57.15 80.52,56.13 82.8,52.58 76.96,52.07 79.5,55.12 78.49,54.1 77.47,55.12 78.49,56.13 71.88,62.74 74.42,62.74 74.42,60.45 76.2,59.18 71.88,59.18 88.57,34.06 94.28,48.79 94.28,50.82 91.11,50.32 94.28,63.75 94.28,65.79 94.28,67.82 94.28,69.85 94.28,71.88 94.28,73.91 89.47,74.47 91.44,72.47 89.41,77.47 87.38,77.47 85.34,77.47 83.31,77.47 68.07,77.47 66.04,77.47 64.01,77.47 53.34,42.42 54.61,41.4 55.63,40.13 54.61,38.86 53.34,37.85 52.07,38.86 51.05,40.13 52.07,41.4 50.16,49.28 52.2,49.28 59.44,49.28 61.47,49.28 56.64,46.99 56.64,43.94 61.98,42.04 61.98,40.01 61.98,37.34 62.48,32.51 65.02,24.13 45.21,31.24 47.24,31.24 44.45,38.1 44.45,36.07 41.15,13.97 41.15,11.94 49.53,59.69 49.53,57.78 49.53,55.88 46.99,59.69 59.69,58.42 62.23,55.88 64.77,55.88 66.04,57.15 67.31,55.88 68.58,57.15 68.83,55.37 62.87,30.48 29.21,27.94 31.11,27.94 33.02,29.84 34.92,29.84 36.83,29.84 41.27,30.48 43.18,29.21 36.83,45.72 11.43,54.61 32.38,43.81 40.01,45.72 36.83,40.01 38.73,40.01 40.64,40.01 29.84,40.01 8.26,38.73 5.71,36.83 12.7,38.73 19.05,38.73 25.4,38.73 40.01,34.92 38.73,34.92 14.61,31.75 15.24,33.02 17.14,33.02 19.05,33.02 20.95,33.02 22.86,33.02 24.77,33.02 80.01,50.8 81.92,51.44 83.82,51.44 85.72,51.44 79.63,45.09 87.63,51.44 79.63,41.91 79.63,40.01 79.63,37.47 92.39,48.4 91.75,35.42 94.29,36.1 79.63,34.92 79.63,32.38 79.63,29.84 79.63,26.42 81.41,27.18 94.29,26.67 94.29,31.48 94.29,33.79 94.29,22.86 94.29,20.32 94.29,16.51 94.29,13.34 94.29,9.53 94.29,6.99 88.9,48.26 88.9,46.35 88.9,44.45 87,46.35 90.17,46.99 89.53,55.24 88.9,38.1 87,41.91 81.92,45.09 87,27.94 88.9,27.94 90.81,27.94 87,26.04 88.9,26.04 90.81,26.04 90.81,24.13 88.9,24.13 87,24.13 69.85,2.54 67.94,2.54 66.04,2.54 62.23,2.54 60.33,2.54 58.42,2.54 54.61,2.54 52.7,2.54 50.8,2.54 46.99,2.54 45.09,2.54 43.18,2.54 39.37,2.54 37.47,2.54 35.56,2.54 31.75,2.54 29.84,2.54 27.94,2.54 24.13,2.54 22.23,2.54 20.32,2.54 4.45,9.53 10.16,8.26 4.45,6.99 11.21,4.67 6.99,2.54 8.89,2.54 12.7,2.54 14.61,2.54 16.51,2.54 6.99,24.77 11.43,27.3 13.34,24.77 15.88,24.77 24.13,24.77 29.21,24.77 31.11,24.77 31.11,22.86 10.79,15.24 10.79,13.34 8.89,13.34 10.79,11.43 12.7,13.34 17.78,17.14 19.68,15.24 21.59,13.34 21.59,17.14 21.59,15.24 19.68,17.14 17.78,15.24 17.78,13.34 19.68,13.34 26.04,13.34 27.94,11.43 27.94,15.24 27.94,13.34 29.84,13.34 45.72,19.68 41.27,19.68 38.86,18.41 57.15,9.4 50.04,8.38 59.05,9.53 61.59,8.89 64.14,8.89 65.41,10.16 66.67,11.43 67.94,12.7 69.22,13.97 70.48,14.73 81.28,10.16 83.19,10.16 85.09,10.16 7.11,55.88 5.84,61.59 5.08,56.52 2.54,58.42 5.08,59.05 4.7,64.14 2.54,63.5 2.54,68.58 6.35,65.41 6.35,69.85 5.08,74.3 1.91,73.03 6.99,77.47 8.89,77.47 10.79,77.47 13.97,77.47 15.88,77.47 22.23,77.47 24.13,77.47 26.67,77.47 38.1,77.47 40.01,77.47 43.18,77.47 45.09,77.47 46.99,77.47 50.16,77.47 52.07,77.47 53.98,77.47 16.51,51.44 22.86,51.44 19.68,57.78 27.3,52.07 27.3,50.16 30.48,52.07 32.38,52.07 36.83,52.07 38.73,52.07 43.69,52.07 46.99,43.18 50.8,33.66 57.78,34.92 69.85,45.72 71.75,45.72 71.12,44.45 73.03,42.55 23.5,60.33 27.94,64.26 20.95,64.77 27.3,69.22 28.57,77.47 35.56,77.47 52.7,69.22 38.1,69.85 40.64,63.5 68.58,74.93 68.58,72.39 71.12,72.39 81.28,74.93 42.42,62.87 46.99,64.77 46.99,62.23 50.16,61.59 49.53,64.77 40.01,73.03 59.69,66.04 60.96,68.58 59.69,63.5 60.96,62.23 63.5,66.04 62.23,67.31 59.69,69.85 57.15,69.85 66.04,71.12 66.04,67.31 68.58,64.77 71.12,67.31 86.36,57.15 83.82,55.88 93.98,57.65 93.98,59.69 94.48,61.23 91.48,69 91.44,66.04 44.45,43.81 44.45,42.55 57.78,59.05 54.61,60.96 53.98,59.69 52.7,59.05 48.9,69.22 48.9,73.03 53.34,73.03 57.15,73.66 59.69,73.66 56.52,77.47 60.96,77.47 46.35,44.45 46.35,39.37 46.35,37.47 46.35,35.56 48.26,35.56 50.16,35.56 52.07,35.56 53.98,35.56 54.61,31.11 55.88,31.75 57.15,33.02 57.78,31.75 62.23,36.2 62.23,43.81 59.69,41.91 59.69,40.01 57.15,36.2 58.42,33.66 55.88,33.66 55.88,35.56 50.16,37.47 48.26,37.47 48.26,39.37 49.53,40.64 53.34,40.01 55.88,42.55 57.78,40.01 57.78,41.91 48.9,46.35 48.9,44.45 50.16,45.09 50.8,46.99 51.44,45.72 52.07,43.81 55.24,45.09 57.15,45.72 59.05,45.72 60.33,45.72 27.3,45.72 44.45,48.26 43.18,49.78 37.59,49.78 36.07,49.78 32.51,49.78 31.5,48.77 31.5,46.74 30.99,45.21 29.46,46.74 42.55,60.45 46.74,57.53 47.24,55.88 43.18,54.36 42.16,56.39 41.66,54.86 40.64,55.88 85.34,66.55 86.36,65.53 85.85,64.01 85.85,61.98 85.85,59.94 65.53,64.01 68.07,61.98 43.69,19.68 41.66,15.24 44.58,9.4 9.14,52.58 33.02,44.58 11.18,49.28 15.75,46.74 17.27,46.74 21.84,46.74 23.24,44.2 81.79,24.38 83.82,22.35 85.85,20.32 80.77,25.4 88.9,10.16 77.22,10.16 86.87,19.3 82.8,23.37 27.94,18.29 84.84,21.34 75.69,11.68 90.93,11.68 87.88,18.29 26.92,19.3 24.89,16.76 75.69,13.21 75.69,14.73 23.88,17.78 90.93,13.21 90.93,14.73 26.92,38.61 8.26,35.18 10.54,36.83 16.76,32 16.26,39.62 20.32,38.1 11.56,23.37 17.78,23.37 14.73,25.91 20.83,27.43 22.35,27.43 22.86,25.91 26.54,26.8 25.02,27.69 27.3,24.77 27.94,29.46 30.99,29.97 65.02,61.98 66.55,60.45 18.54,50.8 21.34,52.07 35.56,19.05 34.54,18.03 33.53,19.05 33.27,14.73 34.29,13.72 35.31,12.7 53.09,6.86 60.2,7.62 55.63,4.57 63.5,5.33 23.24,64.01 28.45,62.74 30.48,62.74 30.48,64.77 32.51,62.74 30.73,73.28 38.1,73.53 33.4,77.6 37.59,62.61 40.13,59.94 41.15,58.93 7.62,45.72 8.89,45.09 10.79,45.09 12.7,45.09 14.61,45.09 4.45,24.77 3.17,20.95 3.17,18.41 5.71,26.04 4.45,27.3 6.99,27.3 6.99,31.11 5.08,31.11 55.24,18.41 53.98,17.14 54.61,24.77 55.24,24.13 42.55,21.59 46.99,20.95 49.53,20.95 50.7,15.24 52.6,18.64 49.38,17.83 48.16,17.83 58.52,27.89 65.84,34.14 66.6,33.38 67.21,32.61 65.23,45.57 48.26,15.24 64.77,30.48 62.87,28.57 64.77,28.57 65.41,27.3 64.14,24.77 73.03,44.45 73.66,41.27 68.58,40.64 69.85,39.37 71.12,38.1 64.31,49.83 65.84,48.62
  pour Top: 44.45,49.02 62.23,49.02 62.23,31.24 44.45,31.24
  pour Bottom: 44.45,49.02 62.23,49.02 62.23,31.24 44.45,31.24
  pour Bottom: 0.25,79.76 96.65,79.76 96.65,0.25 0.25,0.25
  pour Top: 0.38,79.63 96.52,79.63 96.52,0.38 0.38,0.38
INITN
  Top 0.152: U1.110 61.59,51.45 61.86,51.71 64.49,51.71 66.04,50.16 R19.1
IO3
  Top 0.152: U1.6 38.76,46.38 35.43,43.05 7.11,43.05 5.71,44.45 5.71,45.72 5.08,46.35 3.21,46.35 U$4.5
IO4
  Top 0.152: U1.9 37.69,44.88 35.56,42.75 6.99,42.75 6.93,42.75 U$4.6
IO5
  Top 0.152: U1.10 37.62,44.38 35.68,42.44 6.81,42.44 5.43,43.81 3.17,43.81 2,42.64 U$4.7
IO6
  Top 0.152: U1.11 37.55,43.88 35.81,42.14 6.35,42.14 5.89,42.6 U$4.8
IO7
  Top 0.152: U1.12 37.49,43.38 35.94,41.83 6.91,41.83 6.35,41.27 3.17,41.27 2,40.1 U$4.9
IO8
  Top 0.152: U1.13 37.42,42.88 36.06,41.53 7.03,41.53 6.48,40.97 5.45,40.97 U$4.10
IO9
  Top 0.152: U1.14 37.35,42.38 36.19,41.22 7.57,41.22 5.08,38.73 3.17,38.73 2,37.56 U$4.11
IO10
  Top 0.152: U1.15 37.28,41.88 36.32,40.92 7.69,40.92 4.88,38.1 3.81,38.1 3.17,37.47 3.17,36.16 U$4.13
IO11
  Top 0.152: U1.23 36.56,37.88 36.08,37.4 14.54,37.4 10.79,33.66 3.17,33.66 2,32.48 U$4.15
IO12
  Top 0.152: U1.24 36.49,37.38 36.21,37.1 14.67,37.1 10.92,33.35 3.5,33.35 3.17,33.02 3.17,31.07 U$4.17
IO13
  Top 0.152: U1.25 36.43,36.88 36.34,36.79 14.79,36.79 11.05,33.05 3.63,33.05 3.48,32.89 3.48,28.84 U$4.19
IO14
  Top 0.152: U1.26 40.45,36.38 40.26,36.58 36.55,36.58 36.46,36.49 14.92,36.49 11.17,32.74 10.16,32.74 9.88,32.74 4.17,32.74 3.81,32.38 3.81,28.57 3.17,27.94 3.17,26 U$4.21
IO15
  Top 0.152: U1.27 37.78,35.88 37.39,36.27 36.68,36.27 36.59,36.18 15.05,36.18 11.3,32.44 10.16,32.44 10.01,32.44 8.94,32.44 7.62,31.11 7.62,23.5 4.45,20.32 4.45,17.78 3.87,17.2 U$4.27
IO16
  Top 0.152: U1.28 40.41,35.38 40.21,35.58 37.65,35.58 37.26,35.97 36.8,35.97 36.72,35.88 15.17,35.88 11.43,32.13 10.16,32.13 10.13,32.13 9.07,32.13 7.92,30.99 7.92,23.37 4.88,20.33 4.88,17.58 2,14.7 U$4.29
IO17
  Top 0.152: U1.31 38.92,33.88 37.23,35.57 15.3,35.57 11.55,31.83 9.19,31.83 8.26,30.89 8.26,23.27 6.74,21.75 6.74,13.09 5.71,12.06 2.06,12.06 U$4.31
IO18
  Top 0.152: U1.32 38.98,33.38 37.1,35.27 15.43,35.27 11.68,31.52 9.32,31.52 8.56,30.76 8.56,23.14 7.04,21.63 7.04,12.96 5.84,11.76 3.5,11.76 2,10.26 U$4.33
JTAG_TCK
  Top 0.152: U1.131 51.09,57.44 52.07,58.42 52.07,62.61 JP1.7
JTAG_TDI
  Top 0.152: U1.136 48.59,61.67 JP1.5
JTAG_TDO
  Top 0.152: U1.137 48.09,57.15 48.09,57.32 48.09,63.29 JP1.3
JTAG_TMS
  Top 0.152: U1.130 51.59,57.12 52.84,58.37 53.92,58.37 55.5,59.94 JP1.9
JTAGENB
  Top 0.152: U1.120 56.59,53.27 56.09,53.76 R22.1
LED_B
  Top 0.152: U1.41 46.59,28.24 46.13,27.78 46.13,26.91 43.6,24.38 R9.2
LED_G
  Top 0.152: U1.42 47.09,28.31 46.43,27.65 46.43,26.79 R8.2
LED_R  (via drill 0.35)
  Top 0.152: v37.08,27.69 37.8,26.98 44.25,26.98 45.59,28.32 U1.39 | R10.2 37.08,23.96 v37.08,25.4
  Bottom 0.152: v37.08,27.69 v37.08,25.4
MS2_CLOCK  (via drill 0.35)
  Top 0.152: U1.4 34.05,47.38 30.49,43.83 30.49,43.8 30.36,43.66 24.98,43.66 24.32,44.33 24.32,46.8 16.41,54.71 16.41,58.16 20.95,62.71 v20.95,62.87
  Bottom 0.152: R24.2 20.95,62.45 v20.95,62.87 24.36,66.27 PS/2.6
MS2_DATA  (via drill 0.35)
  Top 0.152: U1.5 34.01,46.88 30.48,43.36 24.86,43.36 24.01,44.2 24.01,46.68 16.11,54.58 16.11,63.73 v17.78,65.41
  Bottom 0.152: v17.78,65.41 18,65.62 R23.2 22.25,68.83 PS/2.2
N$1
  Top 0.152: U2.D-1 75.58,72.62 R3.1
N$2  (via drill 0.35)
  Top 0.152: 36.38,21.56 R10.1 36.83,15.75 v37.08,15.49 | v40.64,8.38 42.16,6.86 46.23,6.86 48.26,4.83 49.94,4.83 LED1.P$4
  Bottom 0.152: v37.08,15.49 37.08,11.94 v40.64,8.38
N$3
  Top 0.152: U2.D+1 74.93,73.66 73.37,72.1 R4.1
N$4
  Top 0.152: Q1.3 36.93,49.09 R11.2
N$5  (via drill 0.35)
  Top 0.152: R8.1 39.54,13.04 v39.88,12.7 | v46.99,8.64 48.77,6.86 50.53,6.86 LED1.P$1
  Bottom 0.152: v39.88,12.7 39.88,11.94 43.18,8.64 v46.99,8.64
N$7
  Top 0.152: U$2.8 73.16,68.44 71.75,69.85 71.75,70.75 72.13,71.13 74.33,71.13 R3.2
N$8
  Top 0.254: U$2.6 74.16,64.26 73.66,63.75 71.12,63.75 68.33,66.55 C13.1
N$9
  Top 0.152: R7.2 C14.1 78.58,64.78 78.58,64.77 78.23,64.42 77.63,64.42 76.61,63.39 76.61,63.1 76.71,62.99 76.85,62.85 77,62.71 U$2.46
N$10  (via drill 0.35)
  Top 0.152: R9.1 37.85,22.69 37.85,14.73 v38.86,13.72 | v42.42,7.87 46.23,7.87 48.32,5.78 LED1.P$2
  Bottom 0.152: v38.86,13.72 38.86,11.43 v42.42,7.87
N$11
  Top 0.152: U$2.7 73.66,67.53 R5.2 73.07,70.4 R4.2
N$12
  Top 0.152: R13.2 29.19,44.62 Q1.1
N$13
  Top 0.152: U$2.5 74.66,66.83 R5.1
N$14
  Top 0.152: R6.2 75.58,68.56 75.58,66.37 75.16,65.96 U$2.4
N$16
  Bottom 0.254: R29.1 C19.1 23.07,41.49 R27.2 25.4,41.49 R31.2
N$17
  Top 0.152: U$2.43 79.67,61.21 R12.1 80.94,60.62 81.75,61.43 X1.1 84.16,60.58 C17.1 84.11,57.96
N$18
  Top 0.152: U$2.44 79.66,61.71 R12.2 80.47,62.53 X1.2 82.51,63.33 82.51,64.97 C18.1
N$19
  Bottom 0.254: R28.1 19.68,37.25 C16.2 22.64,37.25 24.13,38.73 R27.1 26.24,39.79 R30.2
N$20
  Bottom 0.152: AUDIO.TIP 13.34,56.52 C24.C
N$22
  Bottom 0.254: R29.2 17.57,41.06 19.27,42.76 C23.1 19.27,47.84 C25.A
N$23
  Bottom 0.254: C24.A 15.03,40.23 C20.2 15.03,36.83 R28.2
N$24
  Bottom 0.152: C25.C 17.79,54.6 12.7,59.69 12.7,67.15 AUDIO.RING
N$25
  Top 0.152: R34.2 R37.1 35.56,66.04 VIDEO.1
N$26
  Top 0.152: R37.2 33.86,60.54 R35.2 R38.1
N$27
  Top 0.152: R38.2 28.78,60.54 R36.2 R42.1
N$28
  Top 0.152: R42.2 R39.2 R43.1
N$29
  Top 0.152: R43.2 29.64,56.09 R40.2 R44.1
N$30
  Top 0.152: R44.2 34.72,56.09 R41.2 R45.1
N$31
  Top 0.152: U$2.2 76.16,65.73 76.44,66.01 76.81,66.01 77.47,66.67 78.11,66.67 78.95,67.53 R46.2
N$32
  Top 0.406: R47.2 57.28,6.73 58.67,5.33 LED2.A
PROGRAMN
  Top 0.152: U1.119 57.09,53.28 57.57,53.76 R21.1
PS2_CLOCK  (via drill 0.35)
  Top 0.152: U1.2 41.03,48.38 39.01,50.39 31.85,50.39 30.73,49.28 30.73,48.24 30.25,47.75 28.2,47.75 26.18,45.73 26.18,45.72 26.05,45.59 24.75,45.59 24.62,45.72 24.62,47.01 17.02,54.61 v17.02,57.91
  Bottom 0.152: v17.02,57.91 13.97,60.96 13.97,64.77 14.82,65.62 R25.2 17.55,67.3 PS/2.5
PS2_DATA  (via drill 0.35)
  Top 0.152: U1.138 47.59,54.01 38.73,62.87 38.73,67.31 37.47,68.58 27.94,68.58 26.67,67.31 v22.86,67.31
  Bottom 0.152: R26.2 17.14,63.5 | 17.14,63.5 17.14,66.04 19.66,68.55 PS/2.1 | 17.14,63.5 18.54,64.89 19.7,64.89 22.11,67.31 v22.86,67.31
SCL  (via drill 0.35)
  Top 0.152: U1.126 53.59,52.75 53.55,52.79 53.55,56.3 53.34,56.52 v53.34,57.15 | R1.1 48.51,74.68 50.16,73.03 51.44,73.03 53.34,74.93 JP4.2
  Bottom 0.152: v53.34,57.15 57.15,60.96 62.23,60.96 63.5,62.23 63.5,64.36 57.15,70.71 57.15,71.75 JP4.2
SDA  (via drill 0.35)
  Top 0.152: U1.125 54.09,52.68 53.86,52.91 53.86,56.31 54.61,57.06 v54.61,57.15 | R2.1 59.52,77.47 57.78,77.47 JP4.3
  Bottom 0.152: v54.61,57.15 58.12,60.66 62.36,60.66 63.8,62.1 63.8,64.48 57.45,70.83 57.45,71.88 55.88,73.46 JP4.3
SEG_A1
  Top 0.152: U1.115 59.09,51.7 60.68,53.29 65.07,53.29 65.68,52.68 70.33,52.68 71.7,51.3 71.7,49.6 75.84,45.46 75.84,20.04 81.05,14.84 U$3.17
SEG_A2
  Top 0.152: U1.127 53.09,56.33 52.73,56.69 52.73,57.4 53.09,57.76 57.72,57.76 60.97,54.51 65.58,54.51 66.19,53.9 70.83,53.9 73,51.73 73,50.03 77.06,45.97 77.06,25.81 88.25,14.62 U$3.12
SEG_B1
  Top 0.152: U1.117 58.09,52.26 59.42,53.59 65.2,53.59 65.81,52.98 70.46,52.98 72.01,51.43 72.01,49.73 76.15,45.59 76.15,21.01 82.48,14.67 U$3.16
SEG_B2
  Top 0.152: U1.128 52.59,56.4 52.43,56.56 52.43,57.53 52.96,58.06 57.85,58.06 61.1,54.81 65.7,54.81 66.31,54.2 70.96,54.2 73.3,51.86 73.3,50.16 77.37,46.09 77.37,26.77 89.69,14.45 89.69,13.6 U$3.11
SEG_C1
  Top 0.152: U1.103 65.38,46.38 73.1,38.66 73.1,9.68 77.09,5.69 79.2,5.69 79.81,5.08 80.64,5.08 81.05,4.68 U$3.4
SEG_C2
  Top 0.152: U1.111 61.09,51.56 61.59,52.07 64.57,52.07 65.2,51.44 69.85,51.44 70.48,50.8 70.48,48.9 74.62,44.76 74.62,10.31 77.72,7.21 79.83,7.21 80.41,6.63 86.72,6.63 88.27,5.08 88.25,5.06 U$3.9
SEG_D1
  Top 0.152: U$3.2 78.17,4.38 77.47,5.08 76.83,5.08 72.49,9.42 72.49,38.41 66.52,44.38 U1.99
SEG_D2
  Top 0.152: U1.106 65.17,47.88 74.02,39.04 74.02,10.05 77.47,6.6 79.58,6.6 80.16,6.02 84.15,6.02 85.36,4.8 U$3.7
SEG_DIG1  (via drill 0.35)
  Top 0.152: U$3.3 79.61,4.85 79.07,5.38 | 79.07,5.38 76.96,5.38 72.8,9.55 72.8,38.53 66.45,44.88 U1.100 | U$3.18 79.61,9.76 v78.74,8.89 | v78.74,5.08 78.77,5.08 79.07,5.38
  Bottom 0.152: v78.74,8.89 v78.74,5.08
SEG_DIG2  (via drill 0.35)
  Top 0.152: U1.107 65.1,48.38 74.32,39.16 74.32,10.18 77.59,6.91 79.7,6.91 80.29,6.33 85.75,6.33 86.81,5.27 86.81,4.63 | U$3.13 86.81,10.35 v87,10.16 | v86.36,5.08 86.81,4.63 | 86.81,4.63 U$3.8
  Bottom 0.152: v87,10.16 87,5.71 v86.36,5.08
SEG_DP1
  Top 0.152: U1.104 65.31,46.88 73.41,38.78 73.41,9.8 77.21,5.99 79.32,5.99 79.93,5.38 81.61,5.38 82.48,4.51 U$3.5
SEG_DP2
  Top 0.152: U1.112 60.59,51.7 61.27,52.38 64.69,52.38 65.33,51.74 69.98,51.74 70.79,50.93 70.79,49.23 74.93,45.09 74.93,10.43 77.84,7.52 79.95,7.52 80.54,6.93 87.68,6.93 89.69,4.93 U$3.10
SEG_E1
  Top 0.152: U$3.1 76.72,4.55 72.19,9.09 72.19,38.28 66.58,43.88 U1.98
SEG_E2
  Top 0.152: U1.105 65.24,47.38 73.71,38.91 73.71,9.93 77.34,6.3 79.45,6.3 80.03,5.71 83.19,5.71 83.92,4.97 U$3.6
SEG_F1
  Top 0.152: U1.114 59.59,51.77 60.81,52.98 64.94,52.98 65.55,52.38 70.2,52.38 71.4,51.18 71.4,49.48 75.54,45.34 75.54,17.8 78.17,15.18 U$3.19
SEG_F2
  Top 0.152: U1.122 55.59,51.61 54.16,53.04 54.16,56.18 54.47,56.49 58.56,56.49 60.85,54.2 65.45,54.2 66.06,53.59 70.71,53.59 72.69,51.61 72.69,49.91 76.76,45.84 76.76,23.57 85.36,14.96 U$3.14
SEG_G1
  Top 0.152: U1.113 60.09,51.84 60.94,52.68 64.82,52.68 65.43,52.07 70.08,52.07 71.09,51.05 71.09,49.35 75.23,45.21 75.23,16.2 76.72,14.71 U$3.20
SEG_G2
  Top 0.152: U1.121 56.09,51.54 54.47,53.16 54.47,56.05 54.6,56.19 58.43,56.19 60.72,53.9 65.32,53.9 65.93,53.29 70.58,53.29 72.39,51.48 72.39,49.78 76.45,45.72 76.45,22.61 83.92,15.13 U$3.15
SN
  Top 0.152: U1.70 61.09,26.97 62.24,25.82 R20.1
SPI_CLK  (via drill 0.35)
  Top 0.152: U1.44 48.09,28.02 v47.75,27.69 | U$1.5 17.18,29.6 18.47,30.88 37.7,30.88 v39.37,29.21
  Bottom 0.152: v47.75,27.69 47.24,28.19 43.18,28.19 42.16,29.21 v39.37,29.21
SPI_CS
  Top 0.152: U1.40 46.09,28.31 44.45,26.67 28.7,26.67 26.67,28.7 26.67,29.58 U$1.1
SPI_MISO  (via drill 0.35)
  Top 0.152: U1.45 48.59,26.49 v48.01,25.91 | 11.68,29.55 U$1.7 12.61,29.6 13.59,30.58 14.78,30.58 15.96,29.4 15.96,28.75 16.09,28.62 17.28,28.62 18.46,29.8 18.46,30.45 18.59,30.58 24.78,30.58 25.96,29.4 25.96,28.75 28.35,26.36 42.22,26.36 v42.67,25.91
  Bottom 0.152: v48.01,25.91 v42.67,25.91
SPI_MOSI
  Top 0.152: U$1.2 24.19,27.12 25.25,26.06 40.01,26.06 40.51,25.56 40.51,20.95 40.64,20.81 45.86,20.81 47.09,19.58 50.27,19.58 51.94,21.26 65.28,21.26 65.73,21.72 65.73,25.7 64.77,26.67 62.23,26.67 61.59,27.31 U1.71
UART_RX  (via drill 0.35)
  Top 0.152: U1.96 65.32,42.88 66.29,41.91 v67.31,41.91
  Bottom 0.152: v67.31,41.91 66.65,42.57 65.79,42.57 65.43,42.93 65.43,43.43 65.79,43.79 66.29,43.79 66.59,43.48 91.77,43.48 JP2.3
UART_TX  (via drill 0.35)
  Top 0.152: U1.97 65.84,43.38 v66.04,43.18
  Bottom 0.152: v66.04,43.18 89.53,43.18 JP2.2
USBAURT_TX  (via drill 0.35)
  Top 0.152: U$2.40 79.99,59.71 v80.64,59.05 | U1.133 50.09,51.92 49.56,52.45 49.56,53.31 49.53,53.34 v49.53,53.98
  Bottom 0.152: v49.53,53.98 50.16,53.98 51.13,53.01 73.97,53.01 80.01,59.05 v80.64,59.05
USBJTAG_TCK
  Top 0.152: U$2.24 65.61,58.21 64.56,59.27 R14.2 59.73,59.27 56.49,62.51 56.49,63.91 55.91,64.49 54.51,64.49 JP1.8
USBJTAG_TDI
  Top 0.152: U$2.23 66.39,58.71 64.52,60.57 64.14,60.57 63.89,60.57 59.09,60.57 56.79,62.87 56.79,64.04 56.04,64.8 55.34,64.8 54.51,65.63 54.51,66.14 53.34,67.31 52.07,67.31 50.8,66.04 JP1.6 50.8,66.42 R15.1
USBJTAG_TDO  (via drill 0.35)
  Top 0.152: U$2.22 66.52,59.21 v60.96,64.77 | R16.1 47.62,66.29 JP1.4
  Bottom 0.152: JP1.4 49.78,67.94 59.05,67.94 60.96,66.04 v60.96,64.77
USBJTAG_TMS
  Top 0.152: U$2.21 69.64,59.69 68.58,59.69 59.69,68.58 56.26,68.58 54.61,66.93 | R17.1 54.61,66.93 | 54.61,66.93 JP1.10
USBUART_RX  (via drill 0.35)
  Top 0.152: U1.132 50.59,52.28 v50.16,52.7 | U$2.39 79.22,59.21 v80.64,57.78
  Bottom 0.152: v50.16,52.7 76.2,52.7 80.64,57.15 v80.64,57.78
VID0
  Top 0.152: U1.142 45.59,52.2 44.45,53.34 36.2,53.34 35.56,53.98 R41.1
VID1
  Top 0.152: U1.143 45.09,52.07 44.12,53.03 36.07,53.03 35.76,53.34 31.11,53.34 30.48,53.98 R40.1
VID2  (via drill 0.35)
  Top 0.152: U1.1 42.08,49.53 v41.27,49.53 | v41.27,52.07 40.62,52.73 31.29,52.73 30.68,53.34 26.04,53.34 25.4,53.98 R39.1
  Bottom 0.152: v41.27,49.53 v41.27,52.07
VID3
  Top 0.152: U1.141 46.09,53.6 42.52,57.17 38.48,57.17 38.18,57.48 29.3,57.48 R36.1
VID4
  Top 0.152: U1.140 46.59,53.34 46.59,53.74 42.85,57.48 38.61,57.48 38.3,57.78 33.66,57.78 33.02,58.42 R35.1
VID5
  Top 0.152: U1.139 47.09,53.88 43.18,57.78 38.73,57.78 38.1,58.42 R34.1

## Text on the board
Top: Z/pdaXrom / 2017-2018 hw1.4